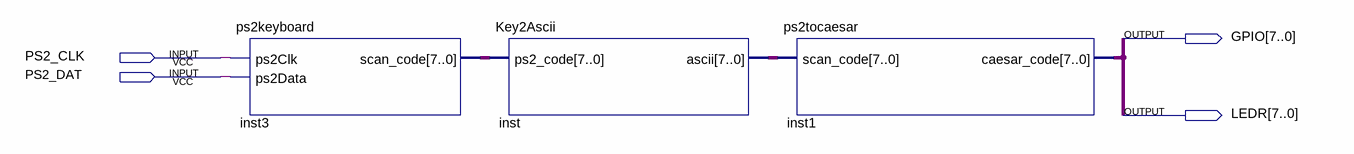
[diagram p0: schematic sheet]
// Quartus schematic schemat_plytka_ps2.bdf as structural Verilog: 3 symbols, 4 pins
module schemat_plytka_ps2 (
  input  PS2_CLK,
  input  PS2_DAT,
  output [7:0] GPIO,
  output [7:0] LEDR
);

  wire [7:0] inst3_scan_code, inst_ascii;

  ps2keyboard inst3 (.ps2Clk(PS2_CLK), .ps2Data(PS2_DAT), .scan_code(inst3_scan_code));
  Key2Ascii inst (.ps2_code(inst3_scan_code), .ascii(inst_ascii));
  ps2tocaesar inst1 (.scan_code(inst_ascii), .caesar_code(GPIO));

  assign LEDR = GPIO;
endmodule
